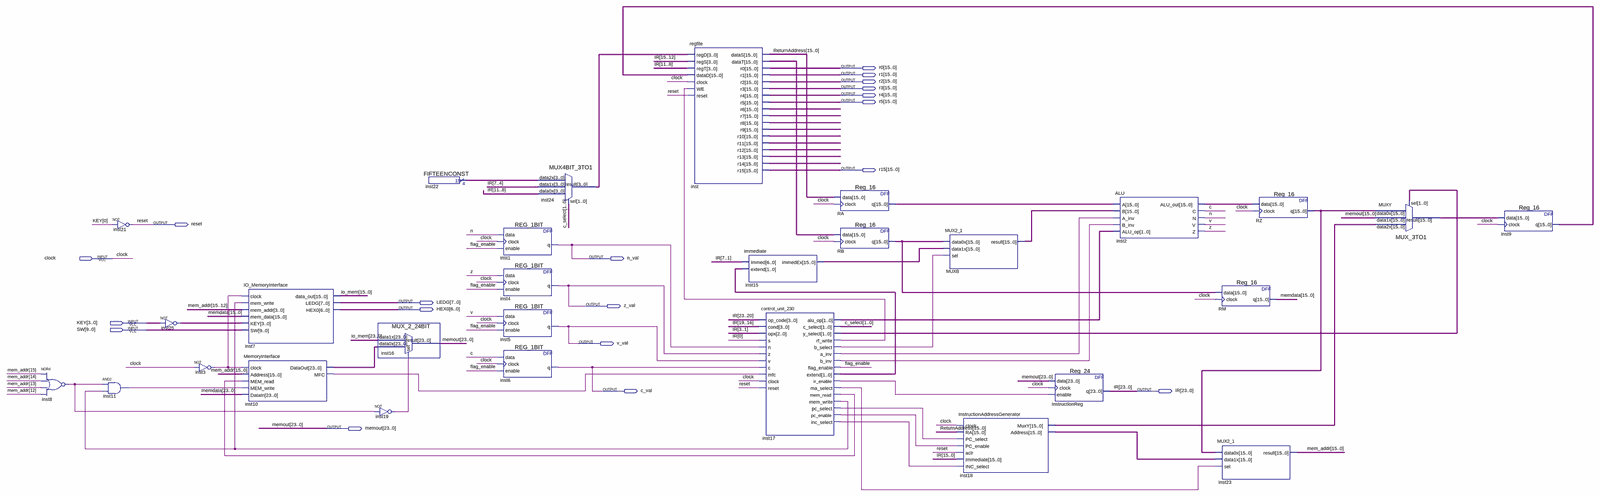
[diagram p0: schematic sheet, whole]
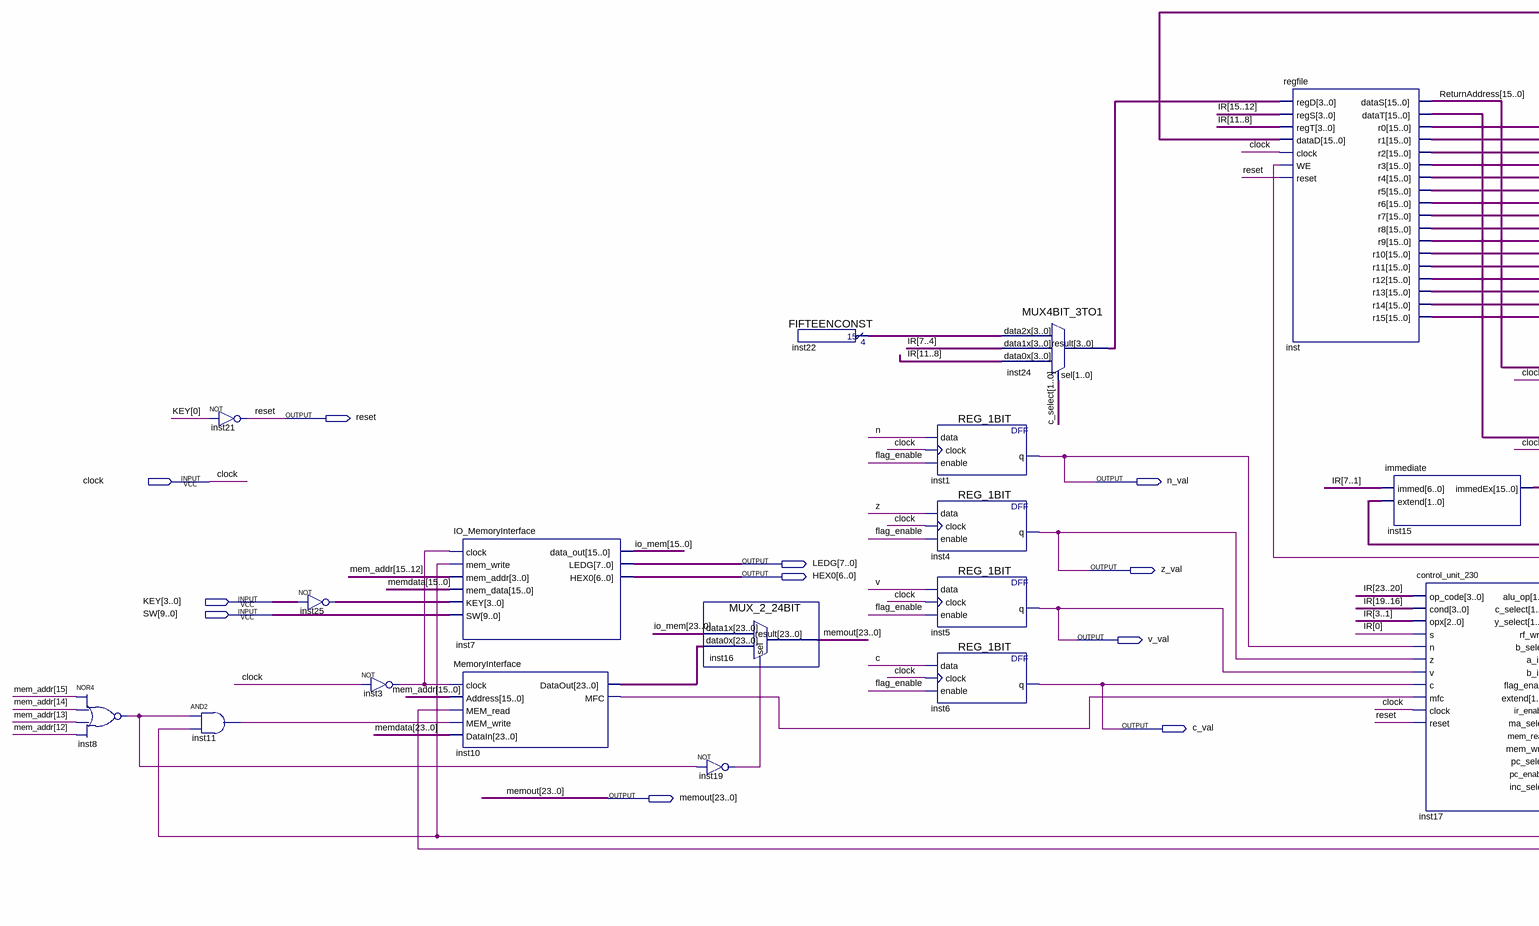
[diagram p1: schematic sheet, left part]
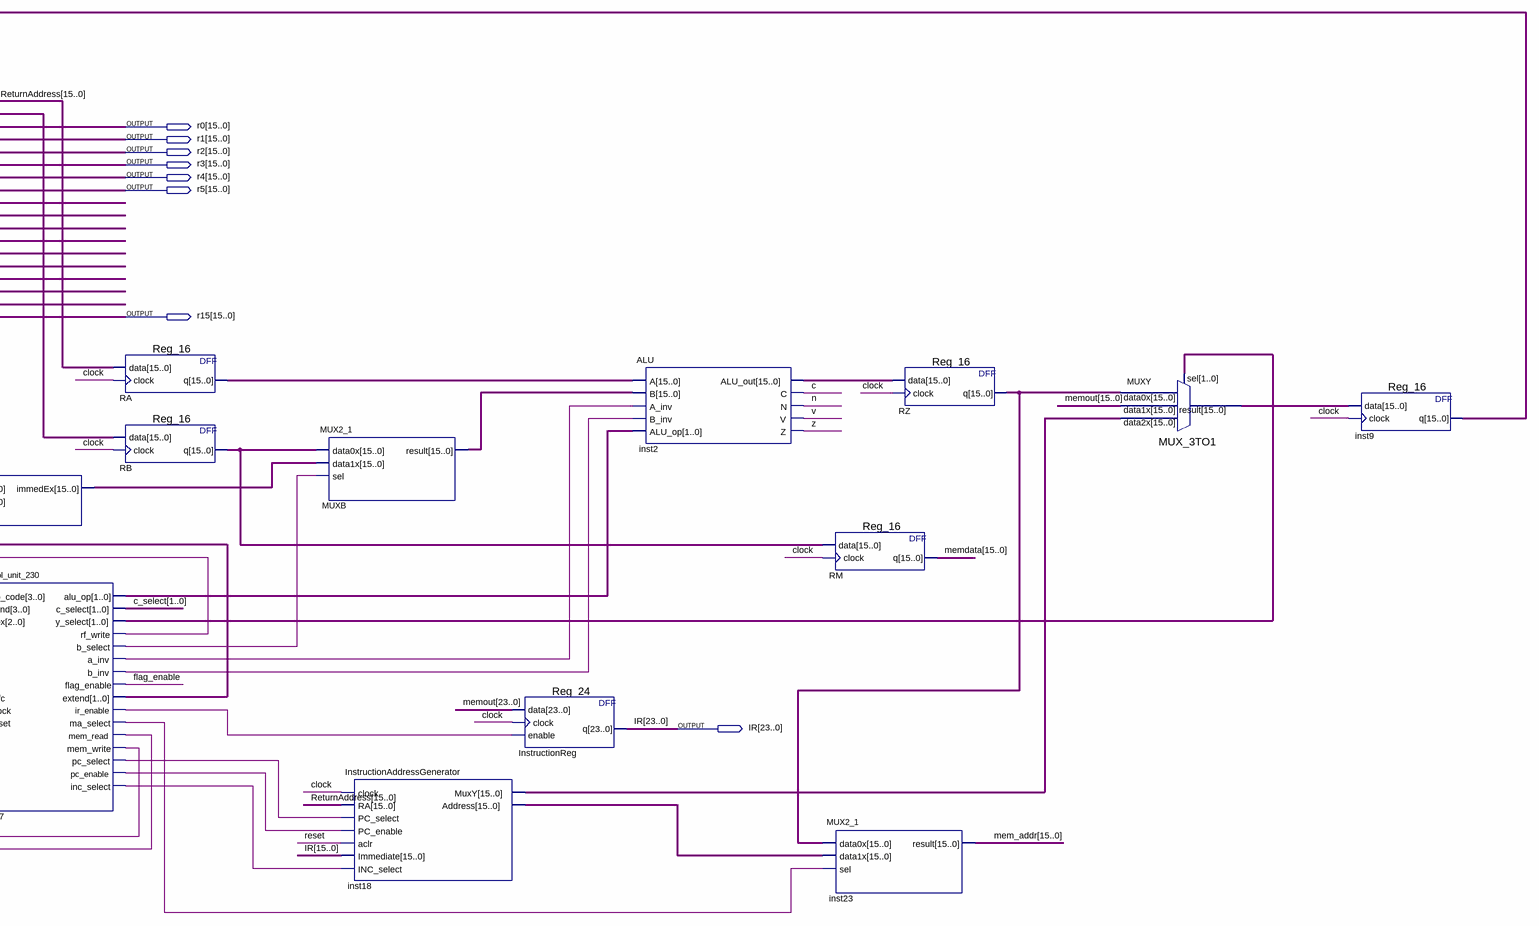
[diagram p2: schematic sheet, right part]
// Quartus schematic processor_old.bdf as structural Verilog: 29 symbols, 19 pins
module processor_old (
  input  clock,
  input  [3:0] KEY,
  input  [9:0] SW,
  output [15:0] r0,
  output [15:0] r1,
  output [15:0] r2,
  output [15:0] r3,
  output [15:0] r4,
  output [15:0] r5,
  output [15:0] r15,
  output reset,
  output n_val,
  output [7:0] LEDG,
  output z_val,
  output [6:0] HEX0,
  output v_val,
  output c_val,
  output [23:0] IR,
  output [23:0] memout
);

  wire c, flag_enable, inst3_out, inst8_out, inst10_mfc, inst11_out, inst17_a_inv, inst17_b_inv,
       inst17_b_select, inst17_inc_select, inst17_ir_enable, inst17_ma_select, inst17_mem_read,
       inst17_mem_write, inst17_pc_enable, inst17_pc_select, inst17_rf_write, inst19_out, n, v, z;
  wire [1:0] c_select, inst17_alu_op, inst17_extend, inst17_y_select;
  wire [3:0] inst22_result, inst24_result, inst25_out;
  wire [15:0] inst2_alu_out, inst9_q, inst15_immedex, inst18_address, inst18_muxy, inst_datat, inst_r6,
       inst_r7, inst_r8, inst_r9, inst_r10, inst_r11, inst_r12, inst_r13, inst_r14, mem_addr, MUXB_result,
       MUXY_result, RA_q, RB_q, ReturnAddress, RZ_q;
  wire [23:0] inst10_dataout, io_mem, memdata;

  nor inst8 (inst8_out, mem_addr[15], mem_addr[14], mem_addr[13], mem_addr[12]);
  not inst21 (reset, KEY[0]);
  and inst11 (inst11_out, inst8_out, inst17_mem_write);
  assign inst25_out = ~KEY;  // NOT inst25, 4 bits wide
  not inst3 (inst3_out, clock);
  IO_MemoryInterface inst7 (
    .clock(inst3_out), .mem_write(inst17_mem_write), .mem_addr(mem_addr[15:12]), .mem_data(memdata[15:0]),
    .KEY(inst25_out), .SW(SW), .data_out(io_mem[15:0]), .LEDG(LEDG), .HEX0(HEX0));
  MemoryInterface inst10 (
    .clock(inst3_out), .Address(mem_addr), .MEM_read(inst17_mem_read), .MEM_write(inst11_out),
    .DataIn(memdata), .DataOut(inst10_dataout), .MFC(inst10_mfc));
  MUX_2_24BIT inst16 (.data1x(io_mem), .data0x(inst10_dataout), .sel(inst19_out), .result(memout));
  not inst19 (inst19_out, inst8_out);
  FIFTEENCONST inst22 (.result(inst22_result));
  REG_1BIT inst1 (.data(n), .clock(clock), .enable(flag_enable), .q(n_val));
  REG_1BIT inst4 (.data(z), .clock(clock), .enable(flag_enable), .q(z_val));
  REG_1BIT inst5 (.data(v), .clock(clock), .enable(flag_enable), .q(v_val));
  REG_1BIT inst6 (.data(c), .clock(clock), .enable(flag_enable), .q(c_val));
  MUX4BIT_3TO1 inst24 (
    .data2x(inst22_result), .data1x(IR[7:4]), .data0x(IR[11:8]), .sel(c_select), .result(inst24_result));
  regfile inst (
    .regD(inst24_result), .regS(IR[15:12]), .regT(IR[11:8]), .dataD(inst9_q), .clock(clock),
    .WE(inst17_rf_write), .reset(reset), .dataS(ReturnAddress), .dataT(inst_datat), .r0(r0), .r1(r1),
    .r2(r2), .r3(r3), .r4(r4), .r5(r5), .r6(inst_r6), .r7(inst_r7), .r8(inst_r8), .r9(inst_r9),
    .r10(inst_r10), .r11(inst_r11), .r12(inst_r12), .r13(inst_r13), .r14(inst_r14), .r15(r15));
  immediate inst15 (.immed(IR[7:1]), .extend(inst17_extend), .immedEx(inst15_immedex));
  control_unit_230 inst17 (
    .op_code(IR[23:20]), .cond(IR[19:16]), .opx(IR[3:1]), .s(IR[0]), .n(n_val), .z(z_val), .v(v_val),
    .c(c_val), .mfc(inst10_mfc), .clock(clock), .reset(reset), .alu_op(inst17_alu_op), .c_select(c_select),
    .y_select(inst17_y_select), .rf_write(inst17_rf_write), .b_select(inst17_b_select), .a_inv(inst17_a_inv),
    .b_inv(inst17_b_inv), .flag_enable(flag_enable), .extend(inst17_extend), .ir_enable(inst17_ir_enable),
    .ma_select(inst17_ma_select), .mem_read(inst17_mem_read), .mem_write(inst17_mem_write),
    .pc_select(inst17_pc_select), .pc_enable(inst17_pc_enable), .inc_select(inst17_inc_select));
  Reg_16 RA (.data(ReturnAddress), .clock(clock), .q(RA_q));
  Reg_16 RB (.data(inst_datat), .clock(clock), .q(RB_q));
  MUX2_1 MUXB (.data0x(RB_q), .data1x(inst15_immedex), .sel(inst17_b_select), .result(MUXB_result));
  InstructionAddressGenerator inst18 (
    .clock(clock), .RA(ReturnAddress), .PC_select(inst17_pc_select), .PC_enable(inst17_pc_enable),
    .aclr(reset), .Immediate(IR[15:0]), .INC_select(inst17_inc_select), .MuxY(inst18_muxy),
    .Address(inst18_address));
  Reg_24 InstructionReg (.data(memout), .clock(clock), .enable(inst17_ir_enable), .q(IR));
  ALU inst2 (
    .A(RA_q), .B(MUXB_result), .A_inv(inst17_a_inv), .B_inv(inst17_b_inv), .ALU_op(inst17_alu_op),
    .ALU_out(inst2_alu_out), .C(c), .N(n), .V(v), .Z(z));
  Reg_16 RM (.data(RB_q), .clock(clock), .q(memdata[15:0]));
  MUX2_1 inst23 (.data0x(RZ_q), .data1x(inst18_address), .sel(inst17_ma_select), .result(mem_addr));
  Reg_16 RZ (.data(inst2_alu_out), .clock(clock), .q(RZ_q));
  MUX_3TO1 MUXY (
    .data2x(inst18_muxy), .data1x(memout[15:0]), .data0x(RZ_q), .sel(inst17_y_select), .result(MUXY_result));
  Reg_16 inst9 (.data(MUXY_result), .clock(clock), .q(inst9_q));
endmodule
